# Altium schematic sheet DriverBoard_Amp.SchDoc
size 594 x 420 mm; DocumentNumber: РД.00.00.01 Э3; SheetNumber: 2; Format: A2
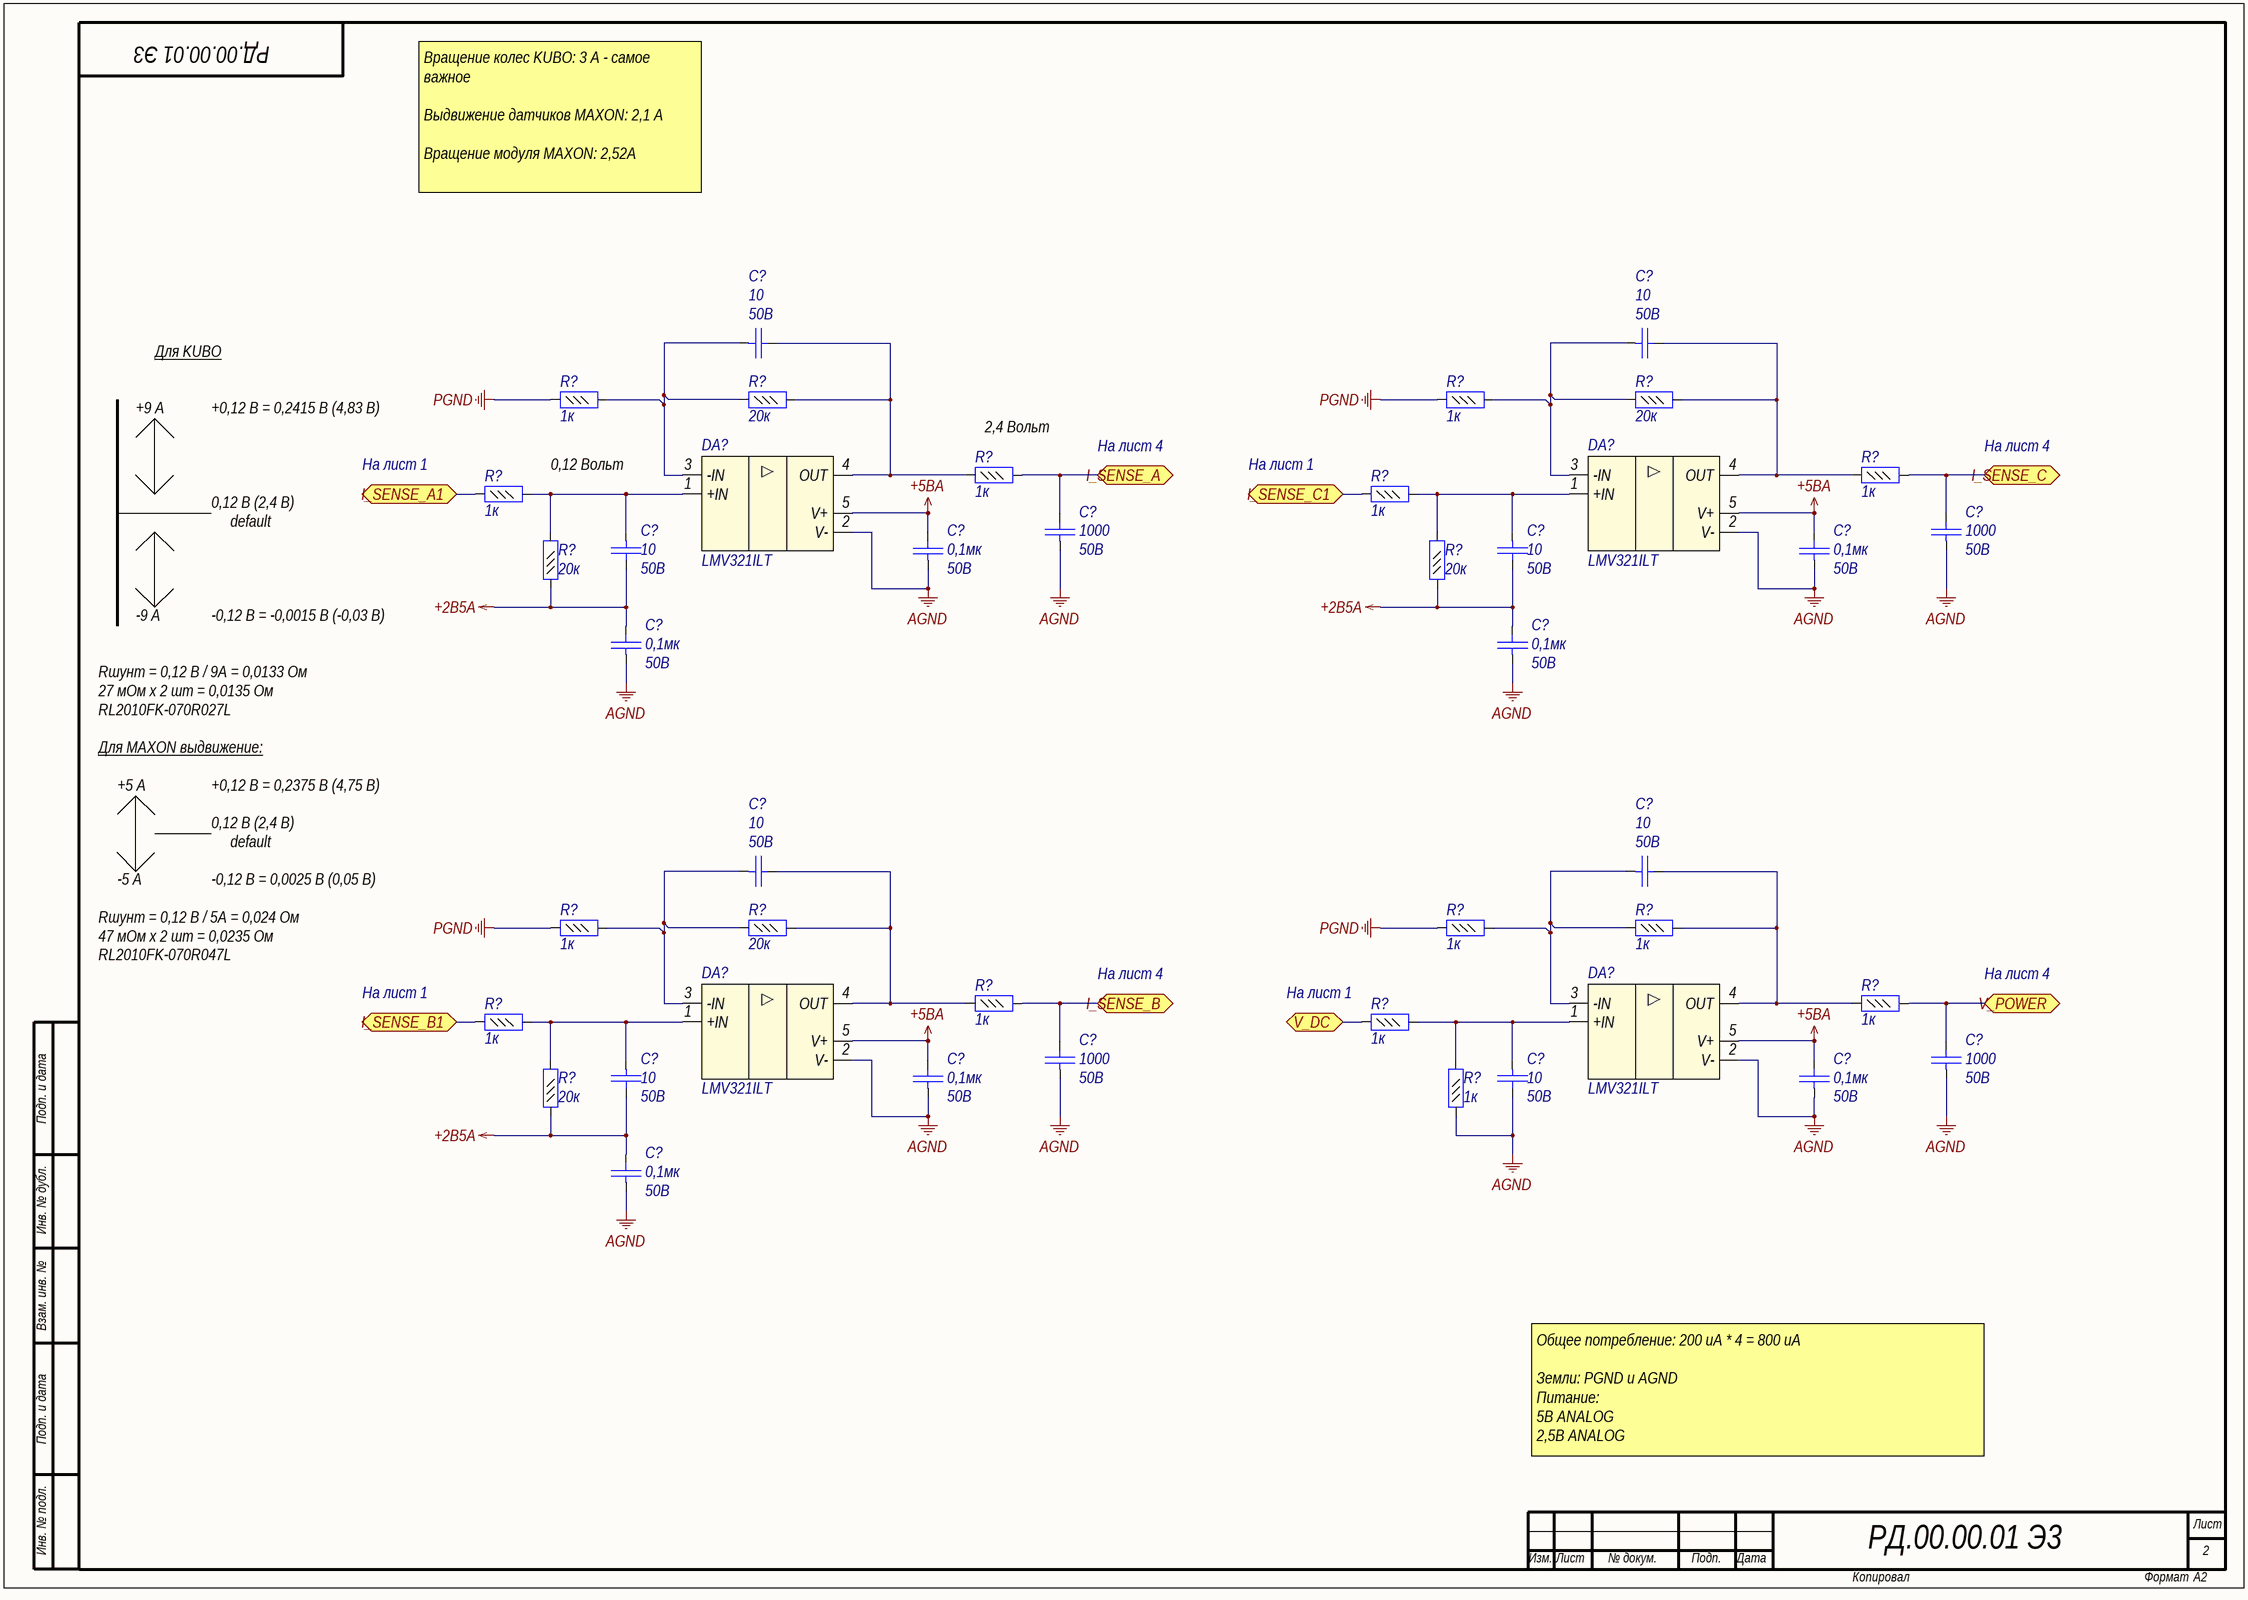
[diagram p0: DriverBoard_Amp.SchDoc]

## Parts
(Parts that share a designator on the sheet are numbered #1, #2 ... from top to bottom, then left to right.)
C?#1  value 10  Voltage: 50B  [C0402]  (hidden comment: Capacitor)
C?#2  value 10  Voltage: 50B  [C0402]  (hidden comment: Capacitor)
C?#3  value 10  Voltage: 50B  [C0402]  (hidden comment: Capacitor)
C?#4  value 10  Voltage: 50B  [C0402]  (hidden comment: Capacitor)
C?#5  value 1000  Voltage: 50B  [C0402]  (hidden comment: Capacitor)
C?#6  value 1000  Voltage: 50B  [C0402]  (hidden comment: Capacitor)
C?#7  value 0,1мк  Voltage: 50В  [C0402]  (hidden comment: Capacitor)
C?#8  value 0,1мк  Voltage: 50В  [C0402]  (hidden comment: Capacitor)
C?#9  value 0,1мк  Voltage: 50В  [C0402]  (hidden comment: Capacitor)
C?#10  value 0,1мк  Voltage: 50В  [C0402]  (hidden comment: Capacitor)
C?#11  value 10  Voltage: 50B  [C0402]  (hidden comment: Capacitor)
C?#12  value 10  Voltage: 50B  [C0402]  (hidden comment: Capacitor)
C?#13  value 10  Voltage: 50B  [C0402]  (hidden comment: Capacitor)
C?#14  value 10  Voltage: 50B  [C0402]  (hidden comment: Capacitor)
C?#15  value 1000  Voltage: 50B  [C0402]  (hidden comment: Capacitor)
C?#16  value 1000  Voltage: 50B  [C0402]  (hidden comment: Capacitor)
C?#17  value 0,1мк  Voltage: 50В  [C0402]  (hidden comment: Capacitor)
C?#18  value 0,1мк  Voltage: 50В  [C0402]  (hidden comment: Capacitor)
C?#19  value 0,1мк  Voltage: 50В  [C0402]  (hidden comment: Capacitor)
DA?#1  LMV321ILT  [SOT23-5]
DA?#2  LMV321ILT  [SOT23-5]
DA?#3  LMV321ILT  [SOT23-5]
DA?#4  LMV321ILT  [SOT23-5]
R?#1  value 1к  [R0402]  (hidden comment: Resistor_0,062Вт)
R?#2  value 20к  [R0402]  (hidden comment: Resistor_0,062Вт)
R?#3  value 1к  [R0402]  (hidden comment: Resistor_0,062Вт)
R?#4  value 20к  [R0402]  (hidden comment: Resistor_0,062Вт)
R?#5  value 1к  [R0402]  (hidden comment: Resistor_0,062Вт)
R?#6  value 1к  [R0402]  (hidden comment: Resistor_0,062Вт)
R?#7  value 1к  [R0402]  (hidden comment: Resistor_0,062Вт)
R?#8  value 1к  [R0402]  (hidden comment: Resistor_0,062Вт)
R?#9  value 20к  [R0402]  (hidden comment: Resistor_0,062Вт)
R?#10  value 20к  [R0402]  (hidden comment: Resistor_0,062Вт)
R?#11  value 1к  [R0402]  (hidden comment: Resistor_0,062Вт)
R?#12  value 20к  [R0402]  (hidden comment: Resistor_0,062Вт)
R?#13  value 1к  [R0402]  (hidden comment: Resistor_0,062Вт)
R?#14  value 1к  [R0402]  (hidden comment: Resistor_0,062Вт)
R?#15  value 1к  [R0402]  (hidden comment: Resistor_0,062Вт)
R?#16  value 1к  [R0402]  (hidden comment: Resistor_0,062Вт)
R?#17  value 1к  [R0402]  (hidden comment: Resistor_0,062Вт)
R?#18  value 1к  [R0402]  (hidden comment: Resistor_0,062Вт)
R?#19  value 20к  [R0402]  (hidden comment: Resistor_0,062Вт)
R?#20  value 1к  [R0402]  (hidden comment: Resistor_0,062Вт)

## Ports
I_SENSE_A, I_SENSE_A1, I_SENSE_B, I_SENSE_B1, I_SENSE_C, I_SENSE_C1, V_DC, V_POWER

## Nets
+2B5A: C?#3.2 C?#4.2 C?#9.2 C?#10.2 C?#13.2 C?#19.2 R?#9.1 R?#10.1 R?#19.1
+5BA: C?#7.2 C?#8.2 C?#17.2 C?#18.2 DA?#1.5(V+) DA?#2.5(V+) DA?#3.5(V+) DA?#4.5(V+)
AGND: C?#5.1 C?#6.1 C?#7.1 C?#8.1 C?#9.1 C?#10.1 C?#14.2 C?#15.1 C?#16.1 C?#17.1 C?#18.1 C?#19.1 DA?#1.2(V-) DA?#2.2(V-) DA?#3.2(V-) DA?#4.2(V-) R?#20.1
PGND: R?#1.1 R?#3.1 R?#11.1 R?#13.1
I_SENSE_A: C?#5.2 R?#5.2 ; port I_SENSE_A
I_SENSE_A1: R?#7.1 ; port I_SENSE_A1
I_SENSE_B: C?#15.2 R?#15.2 ; port I_SENSE_B
I_SENSE_B1: R?#17.1 ; port I_SENSE_B1
I_SENSE_C: C?#6.2 R?#6.2 ; port I_SENSE_C
I_SENSE_C1: R?#8.1 ; port I_SENSE_C1
V_DC: R?#18.1 ; port V_DC
V_POWER: C?#16.2 R?#16.2 ; port V_POWER
NetC?#1_1: C?#1.1 DA?#1.3(-IN) R?#1.2 R?#2.1
NetC?#1_2: C?#1.2 DA?#1.4(OUT) R?#2.2 R?#5.1
NetC?#2_1: C?#2.1 DA?#2.3(-IN) R?#3.2 R?#4.1
NetC?#2_2: C?#2.2 DA?#2.4(OUT) R?#4.2 R?#6.1
NetC?#3_1: C?#3.1 DA?#1.1(+IN) R?#7.2 R?#9.2
NetC?#4_1: C?#4.1 DA?#2.1(+IN) R?#8.2 R?#10.2
NetC?#11_1: C?#11.1 DA?#3.3(-IN) R?#11.2 R?#12.1
NetC?#11_2: C?#11.2 DA?#3.4(OUT) R?#12.2 R?#15.1
NetC?#12_1: C?#12.1 DA?#4.3(-IN) R?#13.2 R?#14.1
NetC?#12_2: C?#12.2 DA?#4.4(OUT) R?#14.2 R?#16.1
NetC?#13_1: C?#13.1 DA?#3.1(+IN) R?#17.2 R?#19.2
NetC?#14_1: C?#14.1 DA?#4.1(+IN) R?#18.2 R?#20.2

## Notes on the sheet
- Вращение колес KUBO: 3 А - самое важное
  Выдвижение датчиков MAXON: 2,1 А
  Вращение модуля MAXON: 2,52А
  Выдвижение УЗ датчика MAXON: 0,748А
- Для KUBO
- +9 А
- +0,12 B = 0,2415 B (4,83 B)
- (near R?#5) 2,4 Вольт
- На лист 4
- На лист 1
- (near R?#7) 0,12 Вольт
- 0,12 B (2,4 B)
- default
- -9 А
- -0,12 B = -0,0015 B (-0,03 B)
- Rшунт = 0,12 B / 9A = 0,0133 Ом
- 27 мОм х 2 шт = 0,0135 Ом
- RL2010FK-070R027L
- Для МAXON выдвижение:
- +5 А
- +0,12 B = 0,2375 B (4,75 B)
- -5 А
- -0,12 B = 0,0025 B (0,05 B)
- Rшунт = 0,12 B / 5A = 0,024 Ом
- 47 мОм х 2 шт = 0,0235 Ом
- RL2010FK-070R047L
- (near R?#18) На лист 1
- Подп. и дата
- Инв. № дубл.
- Взам. инв. №
- Общее потребление: 200 uA * 4 = 800 uA
  Земли: PGND и AGND
  Питание:
  5В ANALOG
  2,5B ANALOG
- Инв. № подл.
- Лист
- Изм.
- № докум.
- Подп.
- Дата
- Копировал
- Формат

## Library data of the parts
C?#1-C?#4 C?#11-C?#14 = cap5: Конденсатор; Part Name: Ceramic; Manufacture: Murata; Part Number: GRM1535C1H100J; id: cap5; TKE: NP0
C?#5 C?#6 C?#15 C?#16 = cap28: Конденсатор; Part Name: Ceramic; Manufacture: Murata; Part Number: GRM1555C1H102J; id: cap28; TKE: NP0
C?#7-C?#10 C?#17-C?#19 = cap277: Конденсатор; Part Name: Ceramic; Manufacture: Murata; Part Number: GRM155R71H104KE14D; id: cap277; TKE: X7R; tga: 0,10%
DA?#1-DA?#4 = amp10: HIGH-DRIVE OPERATIONAL AMPLIFIERS WITH SHUTDOWN; Part Name: Micropower / Operational Amplifiers; Manufacture: ST Microelectronics; id: amp10; Rail-to-rail: yes; Supply Voltage: 2,7-6B; Supply Current max: 200uA; Bandwidth: 1MHz; Input Bias Current: 10nA; CMRR: 85dB; PSRR: 80dB; Offset voltage: 0,1mB; Channels: 1; Part Number: LMV321ILT
R?#1 R?#3 R?#5-R?#8 R?#11 R?#13-R?#18 R?#20 = res270: Резистор; Manufacture: Yageo; Part Number: RC0402FR-071KL; id: res270; Accuracy: 0,01; Part Name: Resistor; Power: 0,062Вт
R?#2 R?#4 R?#9 R?#10 R?#12 R?#19 = res301: Резистор; Manufacture: Yageo; Part Number: RC0402FR-0720KL; id: res301; Accuracy: 0,01; Part Name: Resistor; Power: 0,062Вт